# Altium schematic sheet SENSORS.SchDoc: {Наименование}
size 420 x 297 mm; ApprovedBy: {Утвердил}; CheckedBy: {Проверил}; DrawnBy: {Разраб.}; DocumentNumber: АБВГ 123456.789 00; SheetNumber: 11; SheetTotal: {}; Scale: {Мш.}; PageSetup: Record=PageOptions|CenterHorizontal=False|CenterVertical=False|PrintScale=0.95|XCorrection=0.00|YCorrection=0.00|PrintKind=1|BorderSize=5000000|LeftOffset=0|BottomOffset=0|Orientation=1|PaperLength=1000|PaperWidth=1000|Scale=100|PaperSource=15|PrintQuality=600|MediaType=1|DitherType=10|PaperKind=A4|PrintScaleMode=1; ProcessInspection: {Т.контр.}; Mass: {М.}; NormInspection: {Н.контр.}; Letter1Column: {}; Letter2Column: {}; Letter3Column: {}; DocumentType: {Документ}; Rule: PcbType=ProtelPcb
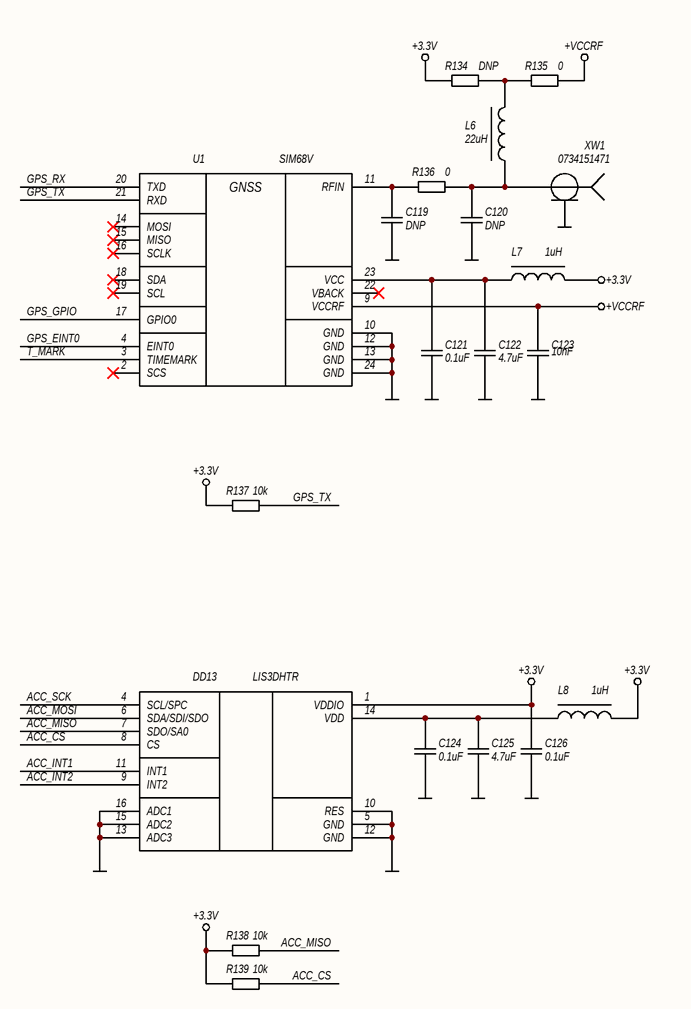
[diagram p0: SENSORS.SchDoc]

## Parts
C119  DNP  [C0603N]  (no BOM)
C120  DNP  [C0603N]  (no BOM)
C121  0.1uF  [C0603N]
C122  4.7uF  [C0603N]
C123  10nF  [C0603N]
C124  0.1uF  [C0603N]
C125  4.7uF  [C0603N]
C126  0.1uF  [C0603N]
DD13  LIS3DHTR  [LGA-16]
L6  22uH  [NLCV32-EF]
L7  1uH  [NLCV32-EF]
L8  1uH  [NLCV32-EF]
R134  DNP  [R0603N]  (no BOM)
R135  0  [R0603N]
R136  0  [R0603N]
R137  10k  [R0603N]
R138  10k  [R0603N]
R139  10k  [R0603N]
U1  SIM68V  [SIM68V]
XW1  0734151471  [0734151471]

## Nets
+3.3V: C126.2 DD13.1(VDDIO) L7.2 L8.2 R134.2 R137.2 R138.2 R139.2
+VCCRF: C123.1 R135.2 U1.9(VCCRF)
GND: C119.1 C120.1 C121.1 C122.1 C123.2 C124.1 C125.1 C126.1 DD13.5(GND) DD13.10(RES) DD13.12(GND) DD13.13(ADC3) DD13.15(ADC2) DD13.16(ADC1) U1.10(GND) U1.12(GND) U1.13(GND) U1.24(GND) XW1.2(GND)
ACC_CS: DD13.8(CS) R139.1
ACC_INT1: DD13.11(INT1)
ACC_INT2: DD13.9(INT2)
ACC_MISO: DD13.7(SDO/SA0) R138.1
ACC_MOSI: DD13.6(SDA/SDI/SDO)
ACC_SCK: DD13.4(SCL/SPC)
GPS_EINT0: U1.4(EINT0)
GPS_GPIO: U1.17(GPIO0)
GPS_RX: U1.20(TXD)
GPS_TX: R137.1 U1.21(RXD)
T_MARK: U1.3(TIMEMARK)
NetC119_2: C119.2 R136.2 U1.11(RFIN)
NetC120_2: C120.2 L6.1 R136.1 XW1.1
NetC121_2: C121.2 C122.2 L7.1 U1.23(VCC)
NetC124_2: C124.2 C125.2 DD13.14(VDD) L8.1
NetL6_2: L6.2 R134.1 R135.1

Not connected (* = marked no-connect by the designer): U1 2(SCS)* 14(MOSI)* 15(MISO)* 16(SCLK)* 18(SDA)* 19(SCL)* 22(VBACK)*

## Notes on the sheet
- Подп. и дата
- Инв. № дубл.
- Взам. инв. №
- Инв. № подл.
- Лист
- Изм.
- № докум.
- Подп.
- Дата
- Копировал
- Формат А3
- (in symbol SIM68V) GNSS

## Library data of the parts
C119 C120 = CC0603CRNPO9BN6R8: Конденсатор; Корпус: 0603 (1608 Metric); Вид монтажа: SMD; Артикул: *; Номинал: DNP; Точность: *; Напряжение: *; Диэлектрик: *; Производитель: *; Описание: *; Строка для документации: *; Температурный диапазон: *; Тип элемента: Конденсатор
C121 C124 C126 = CL10B104KB8NNNC: Конденсатор; Точность: 10%; Напряжение: 50V; Диэлектрик: X7R; Производитель: Samsung Electro-Mechanics; Описание: 0.1 µF ±10% 50V Ceramic Capacitor X7R 0603 (1608 Metric); Корпус: 0603 (1608 Metric); Температурный диапазон: -55°C ~ 125°C; Вид монтажа: SMD; Артикул: CL10B104KB8NNNC; Номинал: 0.1uF; Строка для документации: https://mm.digikey.com/Volume0/opasdata/d220001/medias/docus/609/CL10B104KB8NNNC_Spec.pdf; Тип элемента: Конденсатор
C122 C125 = CL10A475KO8NNNC: Конденсатор; Точность: 10%; Напряжение: 16V; Диэлектрик: X5R; Производитель: Samsung Electro-Mechanics; Описание: 4.7 µF ±10% 16V Ceramic Capacitor X5R 0603 (1608 Metric); Корпус: 0603 (1608 Metric); Температурный диапазон: -55°C ~ 85°C; Вид монтажа: SMD; Артикул: CL10A475KO8NNNC; Номинал: 4.7uF; Строка для документации: https://mm.digikey.com/Volume0/opasdata/d220001/medias/docus/2328/CL10A475KO8NNNC_Spec.pdf; Тип элемента: Конденсатор
C123 = CL10B103KB8NNNC: Конденсатор; Точность: 10%; Напряжение: 16V; Диэлектрик: X7R; Производитель: Samsung Electro-Mechanics; Описание: 10000 pF ±10% 50V Ceramic Capacitor X7R 0603 (1608 Metric); Корпус: 0603 (1608 Metric); Температурный диапазон: -55°C ~ 125°C; Вид монтажа: SMD; Артикул: CL10B103KB8NNNC; Номинал: 10nF; Строка для документации: https://mm.digikey.com/Volume0/opasdata/d220001/medias/docus/609/CL10B103KB8NNNC_Spec.pdf; Тип элемента: Конденсатор
DD13 = LIS3DHTR: Микросхема MEMS акселерометр; Производитель: STMicroelectronics; Описание: Accelerometer X, Y, Z Axis ±2g, 4g, 8g, 16g 0.5Hz ~ 625Hz 16-LGA (3x3); Корпус: 16-LGA (3x3); Температурный диапазон: -40°C ~ 85°C (TA); Вид монтажа: SMD; Артикул: LIS3DHTR; Строка для документации: https://www.st.com/content/ccc/resource/technical/document/datasheet/3c/ae/50/85/d6/b1/46/fe/CD00274221.pdf/files/CD00274221.pdf/jcr:content/translations/en.CD00274221.pdf; Тип элемента: Микросхема
L6 = NLCV32T-220K-EF: Дроссель с магнитопроводом; Точность: 20%; Ток номинальный: 0.3A; Сопротивление: 770m; Производитель: TDK Corporation; Описание: 22 µH Unshielded Drum Core, Wirewound Inductor 300 mA 1.001Ohm Max 1210 (3225 Metric); Корпус: 1210 (3225 Metric); Температурный диапазон: -40°C ~ 105°C; Вид монтажа: SMD; Артикул: NLCV32T-220K-EF; Номинал: 22uH; Строка для документации: https://product.tdk.com/en/system/files?file=dam/doc/product/inductor/inductor/smd/catalog/inductor_commercial_decoupling_nlcv32-ef_en.pdf; Тип элемента: Дроссель
L7 L8 = NLCV32T-1R0M-EF: Дроссель с магнитопроводом; Точность: 20%; Ток номинальный: 1A; Сопротивление: 60m; Производитель: TDK Corporation; Описание: 1 µH Unshielded Drum Core, Wirewound Inductor 1 A 78mOhm Max 1210 (3225 Metric); Корпус: 1210 (3225 Metric); Температурный диапазон: -40°C ~ 105°C; Вид монтажа: SMD; Артикул: NLCV32T-1R0M-EF; Номинал: 1uH; Строка для документации: https://product.tdk.com/en/system/files?file=dam/doc/product/inductor/inductor/smd/catalog/inductor_commercial_decoupling_nlcv32-ef_en.pdf; Тип элемента: Дроссель
R134-R136 = RC0603FR-070RL: Резистор; Точность: 1%; Напряжение: 75V; Производитель: YAGEO; Описание: 0 Ohms Jumper Chip Resistor 0603 (1608 Metric) Moisture Resistant Thick Film; Корпус: 0603 (1608 Metric); Температурный диапазон: -55°C ~ 155°C; Вид монтажа: SMD; Артикул: RC0603FR-070RL; Строка для документации: https://www.yageo.com/upload/media/product/app/datasheet/rchip/pyu-rc_group_51_rohs_l.pdf; Тип элемента: Резистор
  R134: Номинал: DNP
  R135 R136: Номинал: 0
R137-R139 = RC0603FR-0710KL: Резистор; Точность: 1%; ТКС: ±100ppm/°C; Напряжение: 75V; Производитель: YAGEO; Описание: 10 kOhms ±1% 0.1W, 1/10W Chip Resistor 0603 (1608 Metric) Moisture Resistant Thick Film; Корпус: 0603 (1608 Metric); Температурный диапазон: -55°C ~ 155°C; Вид монтажа: SMD; Артикул: RC0603FR-0710KL; Номинал: 10k; Строка для документации: https://www.yageo.com/upload/media/product/app/datasheet/rchip/pyu-rc_group_51_rohs_l.pdf; Тип элемента: Резистор
U1 = SIM68V: Модуль GNSS приемника; Описание: Navigation Galileo, GLONASS, GPS, GNSS, Module 1.166GHz ~ 1.186GHz, 1.559GHz ~ 1.563GHz, 1.595GHz ~ 1.607GHz, 1.574GHz ~ 1.576GHz Antenna Not Included Surface Mount; Тип: RF Module; Производитель: SIMCom Wireless Solutions Limited; Температурный диапазон: -40°C ~ 85°C; Вид монтажа: SMD; Тип элемента: RF модуль; Артикул: SIM68V; Строка для документации: https://www.tme.eu/Document/99bff817e100899e64922f28987a196f/SIM68V.pdf
XW1 = 0734151471: ВЧ соединитель; Тип разъема: Coaxial Connector, RF; Количество контактов: 1; Напряжение: 170V; Производитель: Molex; Описание: MMCX Connector Jack, Female Socket 50 Ohms Through Hole Solder; Температурный диапазон: -55°C ~ 165°C; Вид монтажа: Through Hole; Тип элемента: Разъем; Артикул: 0734151471; Строка для документации: https://www.molex.com/pdm_docs/sd/734151471_sd.pdf